# Altium schematic sheet 13_eMMC Flash.schdoc
size 309 x 223 mm; Symbol: Sheet-Symbol_A4; Device: Sheet-Symbol_A4; Company: 嘉立创EDA; Version: V1.0; Page Size: A4; @Project Name: RK3568核心板; @Page Count: 14; @Update Date: 2024-10-11; @Create Date: 2024-10-10; @Schematic Name: Schematic1; @Page No: 13; @Page Name: eMMC Flash; @Board Name: Board1; @Create Time: 14:33:53; @Update Time: 10:52:44
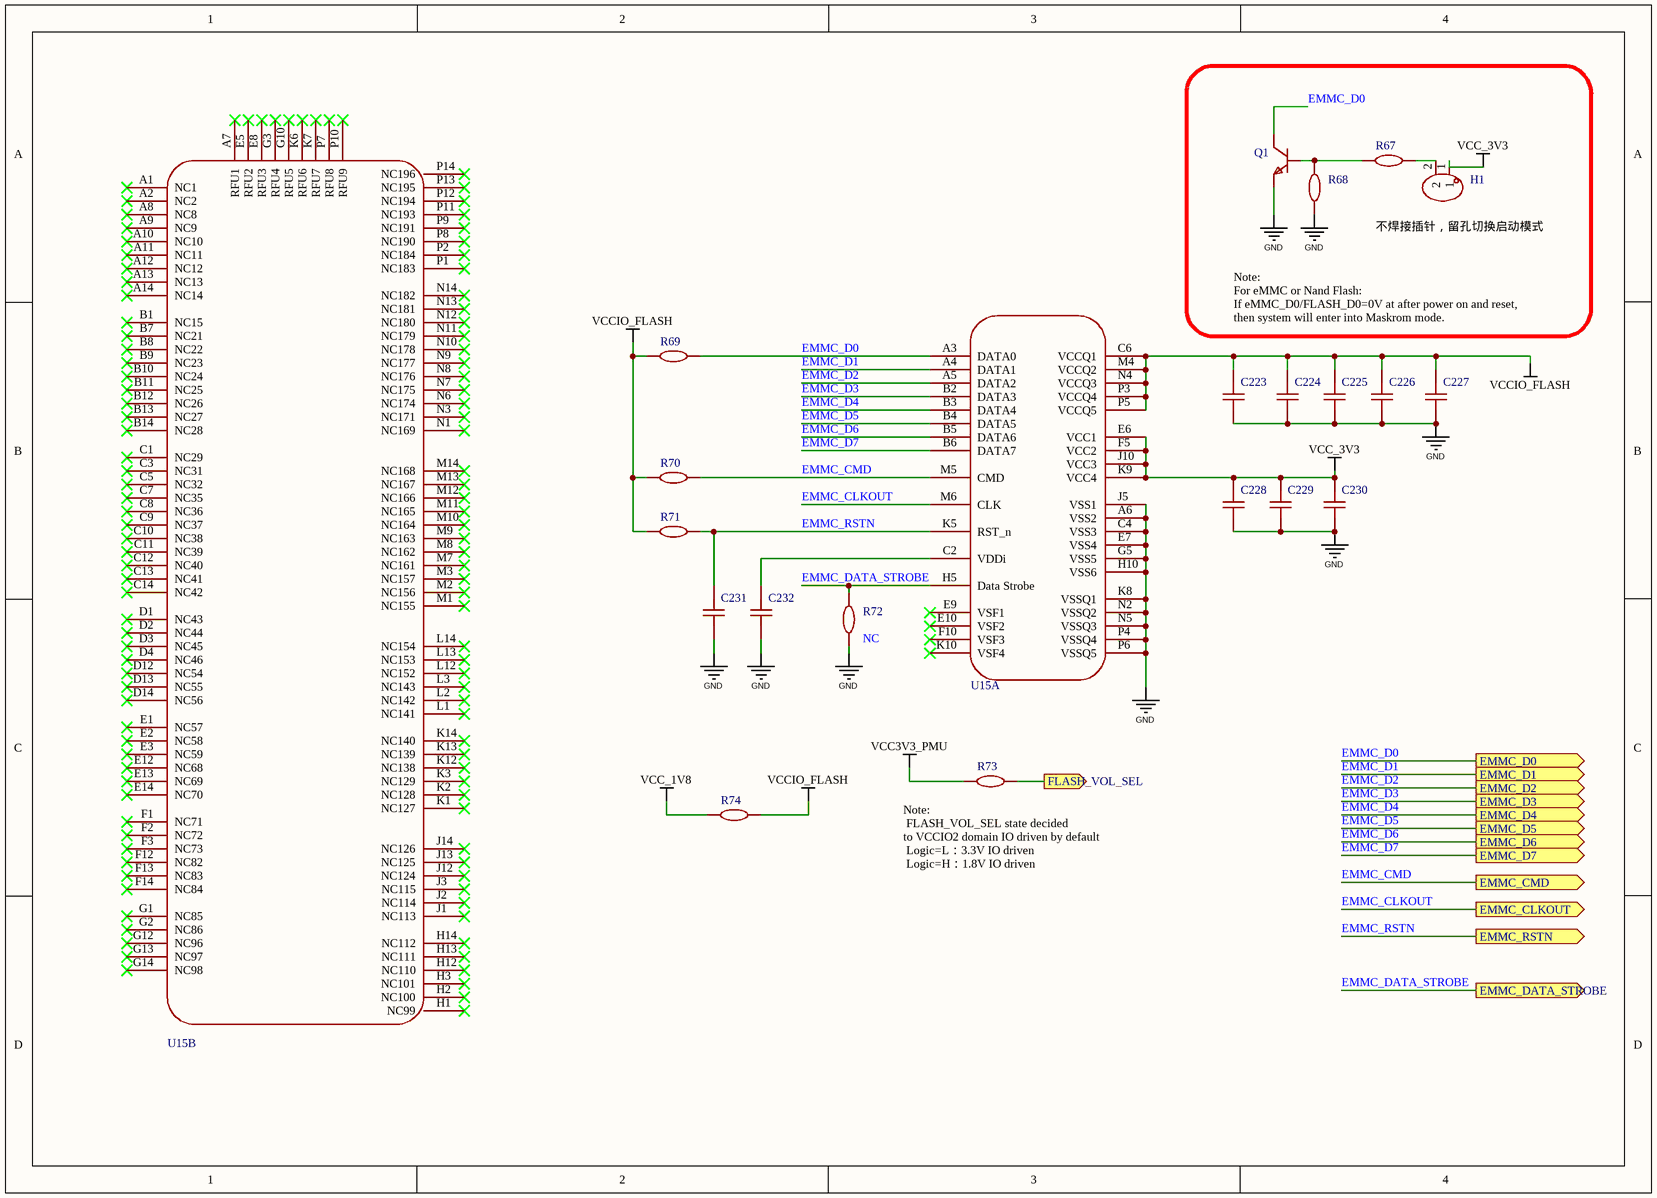
[diagram p0: 13_eMMC Flash.schdoc]

## Parts
C223  100nF  [C0402]  (value not drawn)
C224  100nF  [C0402]  (value not drawn)
C225  100nF  [C0402]  (value not drawn)
C226  100nF  [C0402]  (value not drawn)
C227  4.7uF  [C0402]  (value not drawn)
C228  100nF  [C0402]  (value not drawn)
C229  100nF  [C0402]  (value not drawn)
C230  4.7uF  [C0402]  (value not drawn)
C231  100nF  [C0402]  (value not drawn)
C232  2.2uF  [C0402]  (value not drawn)
H1  PZ254V-11-02P  [HDR-TH_2P-P2.54-V-M]  (value not drawn)
Q1  SS8050  [SOT-23-3_L2.9-W1.3-P1.90-LS2.4-BR]  (value not drawn)
R67  10kΩ  [R0402]  (value not drawn)
R68  47kΩ  [R0402]  (value not drawn)
R69  10kΩ  [R0402]  (value not drawn)
R70  10kΩ  [R0402]  (value not drawn)
R71  10kΩ  [R0402]  (value not drawn)
R72  47kΩ  [R0402]  (value not drawn)
R73  10kΩ  [R0402]  (value not drawn)
R74  0Ω  [R0603]  (value not drawn)
U15  KLMBG2JETD-B041  [FBGA-153_L8.5-W8.0-P0.50_EMMC32G-KC30-01]  (value not drawn)  (parts A,B of 2)

## Blocks framed on the sheet
不焊接插针，留孔切换启动模式: H1 Q1 R67 R68

## Ports
EMMC_CLKOUT (out), EMMC_CMD (out), EMMC_D0 (out), EMMC_D1 (out), EMMC_D2 (out), EMMC_D3 (out), EMMC_D4 (out), EMMC_D5 (out), EMMC_D6 (out), EMMC_D7 (out), EMMC_DATA_STROBE (out), EMMC_RSTN (out), FLASH_VOL_SEL (out)

## Nets
GND: C223.1 C224.1 C225.1 C226.1 C227.1 C228.1 C229.1 C230.1 C231.1 C232.2 Q1.2(E) R68.1 R72.1 U15.A6(VSS2) U15.C4(VSS3) U15.E7(VSS4) U15.G5(VSS5) U15.H10(VSS6) U15.J5(VSS1) U15.K8(VSSQ1) U15.N2(VSSQ2) U15.N5(VSSQ3) U15.P4(VSSQ4) U15.P6(VSSQ5)
VCC3V3_PMU: R73.1
VCC_1V8: R74.1
VCC_3V3: C228.2 C229.2 C230.2 H1.1 U15.E6(VCC1) U15.F5(VCC2) U15.J10(VCC3) U15.K9(VCC4)
VCCIO_FLASH: C223.2 C224.2 C225.2 C226.2 C227.2 R69.1 R70.1 R71.1 R74.2 U15.C6(VCCQ1) U15.M4(VCCQ2) U15.N4(VCCQ3) U15.P3(VCCQ4) U15.P5(VCCQ5)
EMMC_CLKOUT: U15.M6(CLK) ; port EMMC_CLKOUT
EMMC_CMD: R70.2 U15.M5(CMD) ; port EMMC_CMD
EMMC_D0: Q1.3(C) R69.2 U15.A3(DATA0) ; port EMMC_D0
EMMC_D1: U15.A4(DATA1) ; port EMMC_D1
EMMC_D2: U15.A5(DATA2) ; port EMMC_D2
EMMC_D3: U15.B2(DATA3) ; port EMMC_D3
EMMC_D4: U15.B3(DATA4) ; port EMMC_D4
EMMC_D5: U15.B4(DATA5) ; port EMMC_D5
EMMC_D6: U15.B5(DATA6) ; port EMMC_D6
EMMC_D7: U15.B6(DATA7) ; port EMMC_D7
EMMC_DATA_STROBE: R72.2 U15.H5(Data_Strobe) ; port EMMC_DATA_STROBE
EMMC_RSTN: C231.2 R71.2 U15.K5(RST_n) ; port EMMC_RSTN
FLASH_VOL_SEL: R73.2 ; port FLASH_VOL_SEL
NetC232_1: C232.1 U15.C2(VDDi)
NetH1_2: H1.2 R67.2
NetQ1_1: Q1.1(B) R67.1 R68.2

Not connected (* = marked no-connect by the designer): U15 A1(NC1)* A2(NC2)* A7(RFU1)* A8(NC8)* A9(NC9)* A10(NC10)* A11(NC11)* A12(NC12)* A13(NC13)* A14(NC14)* B1(NC15)* B7(NC21)* B8(NC22)* B9(NC23)* B10(NC24)* B11(NC25)* B12(NC26)* B13(NC27)* B14(NC28)* C1(NC29)* C3(NC31)* C5(NC32)* C7(NC35)* C8(NC36)* C9(NC37)* C10(NC38)* C11(NC39)* C12(NC40)* C13(NC41)* C14(NC42)* D1(NC43)* D2(NC44)* D3(NC45)* D4(NC46)* D12(NC54)* D13(NC55)* D14(NC56)* E1(NC57)* E2(NC58)* E3(NC59)* E5(RFU2)* E8(RFU3)* E9(VSF1)* E10(VSF2)* E12(NC68)* E13(NC69)* E14(NC70)* F1(NC71)* F2(NC72)* F3(NC73)* F10(VSF3)* F12(NC82)* F13(NC83)* F14(NC84)* G1(NC85)* G2(NC86)* G3(RFU4)* G10(RFU5)* G12(NC96)* G13(NC97)* G14(NC98)* H1(NC99)* H2(NC100)* H3(NC101)* H12(NC110)* H13(NC111)* H14(NC112)* J1(NC113)* J2(NC114)* J3(NC115)* J12(NC124)* J13(NC125)* J14(NC126)* K1(NC127)* K2(NC128)* K3(NC129)* K6(RFU6)* K7(RFU7)* K10(VSF4)* K12(NC138)* K13(NC139)* K14(NC140)* L1(NC141)* L2(NC142)* L3(NC143)* L12(NC152)* L13(NC153)* L14(NC154)* M1(NC155)* M2(NC156)* M3(NC157)* M7(NC161)* M8(NC162)* M9(NC163)* M10(NC164)* M11(NC165)* M12(NC166)* M13(NC167)* M14(NC168)* N1(NC169)* N3(NC171)* N6(NC174)* N7(NC175)* N8(NC176)* N9(NC177)* N10(NC178)* N11(NC179)* N12(NC180)* N13(NC181)* N14(NC182)* P1(NC183)* P2(NC184)* P7(RFU8)* P8(NC190)* P9(NC191)* P10(RFU9)* P11(NC193)* P12(NC194)* P13(NC195)* P14(NC196)*

## Notes on the sheet
- Note:
  For eMMC or Nand Flash:
  If eMMC_D0/FLASH_D0=0V at after power on and reset,
  then system will enter into Maskrom mode.
- (near R72) NC
- (near R73) Note:
  FLASH_VOL_SEL state decided
  to VCCIO2 domain IO driven by default
  Logic=L：3.3V IO driven
  Logic=H：1.8V IO driven
- 1
- 2
- 3
- 4
- 5
- 6
- A
- B
- C
- 原理图
- Schematic1
- 创建日期
- 更新日期
- 2024-10-11
- 2024-10-10
- 审阅
- 绘制
- 图页
- eMMC Flash
- 物料编码
- RK3568核心板
- D
- 版本
- 尺寸
- 页
- 13
- 共
- 14
- V1.0
- A4
- 嘉立创EDA

## Library data of the parts
C223-C226 C228 C229 C231 = CL05B104KB54PNC: 容值:100nF;精度:±10%;额定电压:50V;材质(温度系数):X7R;; Manufacturer: SAMSUNG(三星); Add into BOM: yes; Tolerance: ±10%; Voltage Rated: 50V; Temperature Coefficient: X7R; Symbol: CL05B104KB54PNC; Device: CL05B104KB54PNC; LCSC Part Name: 100nF ±10% 50V; Supplier Part: C307331; Manufacturer Part: CL05B104KB54PNC; Supplier Footprint: 0402; JLCPCB Part Class: 基础库; Datasheet: https://atta.szlcsc.com/upload/public/pdf/source/20160218/1457707763339.pdf; Supplier: LCSC; Convert to PCB: yes; Value: 100nF
C227 C230 = CL05A475KP5NRNC: 容值:4.7uF;精度:±10%;额定电压:10V;材质(温度系数):X5R;; Manufacturer: SAMSUNG(三星); Add into BOM: yes; Tolerance: ±10%; Voltage Rated: 10V; Temperature Coefficient: X5R; Symbol: CL05A475KP5NRNC; Device: CL05A475KP5NRNC; Supplier: LCSC; Supplier Part: C368809; Manufacturer Part: CL05A475KP5NRNC; Value: 4.7uF; JLCPCB Part Class: 扩展库; LCSC Part Name: 4.7uF ±10% 10V; Supplier Footprint: 0402; Datasheet: https://atta.szlcsc.com/upload/public/pdf/source/20160218/1457707763339.pdf; Convert to PCB: yes
C232 = CL05A225KO5NQNC: 容值:2.2uF;精度:±10%;额定电压:16V;材质(温度系数):X5R;; Manufacturer: SAMSUNG(三星); Add into BOM: yes; Tolerance: ±10%; Voltage Rated: 16V; Temperature Coefficient: X5R; Symbol: CL05A225KO5NQNC; Device: CL05A225KO5NQNC; LCSC Part Name: 2.2uF ±10% 16V; Supplier Part: C170151; Manufacturer Part: CL05A225KO5NQNC; Supplier Footprint: 0402; JLCPCB Part Class: 扩展库; Datasheet: https://atta.szlcsc.com/upload/public/pdf/source/20160218/1457707763339.pdf; Supplier: LCSC; Convert to PCB: yes; Value: 2.2uF
H1 = PZ254V-11-02P: 插针结构:1x2P;间距:2.54mm;行距:-;圆针/方针:方针;安装类型:直插;排数:单排;总PIN位数:2P;额定电流:-;额定电压:-;配合针长度:6mm;塑高:2.5mm;端接针长度:3mm;触头材质:黄铜;触头镀层:-;工作温度范围:-40℃~+105℃;颜色:黑色;; Manufacturer: XFCN(兴飞); Add into BOM: yes; Pin Structure: 1x2P; Pitch: 2.54mm; Circluar Pins/Square Pins: 方针; Symbol: PZ254V-11-02P; Device: PZ254V-11-02P; Supplier: LCSC; Supplier Part: C492401; Manufacturer Part: PZ254V-11-02P; JLCPCB Part Class: 扩展库; LCSC Part Name: 间距:2.54mm 1x2P 直插 方针; Supplier Footprint: 插件,P=2.54mm; Datasheet: https://atta.szlcsc.com/upload/public/pdf/source/20200309/C492401_A812433581A9B211A7FFA413ADDFF0E5.pdf; Convert to PCB: yes; Row Spacing: -; Mounting Type: 直插; Number of Rows: 单排; Number of Pins: 2P; Current Rating (Max): -; Voltage Rating (Max): -; Length of Mating Pin: 6mm; Insulation Height: 2.5mm; Length of End Connection Pin: 3mm; Contact Material: 黄铜; Contact Plating: -; Operating Temperature Range: -40℃~+105℃; Color: 黑色
Q1 = SS8050_C2150: 晶体管类型:NPN;集电极电流(Ic):1.5A;集射极击穿电压(Vceo):25V;功率(Pd):300mW;直流电流增益(hFE@Ic,Vce):200@100mA,1V;; Manufacturer: CJ(江苏长电/长晶); Add into BOM: yes; Transistor Type: NPN; Collector Current (Ic): 1.5A; Collector-Emitter Breakdown Voltage (Vceo): 25V; Power Dissipation (Pd): 300mW; Transition Frequency (fT): 100MHz; Collector Cut-Off Current (Icbo): 100nA; Collector-Emitter Saturation Voltage (VCE(sat)@Ic,Ib): 500mV@800mA,80mA; Symbol: SS8050_C2150; Device: SS8050_C2150; LCSC Part Name: SS8050(RANGE:200-350) hfe=200~350; Supplier Part: C2150; Manufacturer Part: SS8050; Supplier Footprint: SOT-23; JLCPCB Part Class: 基础库; Datasheet: https://atta.szlcsc.com/upload/public/pdf/source/20230322/AEE86F4B043774EFF80CAEA14A37D9E9.pdf; Supplier: LCSC; Convert to PCB: yes; DC Current Gain (hFE@Ic,Vce): 200@100mA,1V; Operating Temperature: -
R67 R69-R71 R73 = 0402WGF1002TCE: 电阻类型:厚膜电阻;阻值:10kΩ;精度:±1%;功率:62.5mW;最大工作电压:50V;温度系数:±100ppm/℃;; Manufacturer: UNI-ROYAL(厚声); Add into BOM: yes; Tolerance: ±1%; Power(Watts): 62.5mW; Overload Voltage (Max): 50V; Symbol: 0402WGF1002TCE; Device: 0402WGF1002TCE; LCSC Part Name: 10kΩ ±1% 62.5mW 厚膜电阻; Supplier Part: C25744; Manufacturer Part: 0402WGF1002TCE; Supplier Footprint: 0402; JLCPCB Part Class: 基础库; Datasheet: https://atta.szlcsc.com/upload/public/pdf/source/20200306/C422600_1E6D84923E4A46A82E41ADD87F860B5C.pdf; Supplier: LCSC; Convert to PCB: yes; Type: 厚膜电阻; Value: 10kΩ; Temperature Coefficient: ±100ppm/℃; Operating Temperature Range: -55℃~+155℃
R68 R72 = 0402WGF4702TCE: 电阻类型:厚膜电阻;阻值:47kΩ;精度:±1%;功率:62.5mW;最大工作电压:50V;温度系数:±100ppm/℃;; Manufacturer: UNI-ROYAL(厚声); Add into BOM: yes; Tolerance: ±1%; Power(Watts): 62.5mW; Overload Voltage (Max): 50V; Symbol: 0402WGF4702TCE; Device: 0402WGF4702TCE; Supplier: LCSC; Manufacturer Part: 0402WGF4702TCE; Supplier Part: C25792; Value: 47kΩ; JLCPCB Part Class: 基础库; LCSC Part Name: 47kΩ ±1% 62.5mW 厚膜电阻; Supplier Footprint: 0402; Datasheet: https://atta.szlcsc.com/upload/public/pdf/source/20200306/C422600_1E6D84923E4A46A82E41ADD87F860B5C.pdf; Convert to PCB: yes; Type: 厚膜电阻; Temperature Coefficient: ±100ppm/℃; Operating Temperature Range: -55℃~+155℃
R74 = 0603WAF0000T5E: 电阻类型:厚膜电阻;阻值:0Ω;精度:±1%;功率:100mW;最大工作电压:75V;; Manufacturer: UNI-ROYAL(厚声); Add into BOM: yes; Tolerance: ±1%; Power(Watts): 100mW; Overload Voltage (Max): 75V; Symbol: 0603WAF0000T5E; Device: 0603WAF0000T5E; LCSC Part Name: 0Ω ±1% 100mW 厚膜电阻; Supplier Part: C21189; Manufacturer Part: 0603WAF0000T5E; Supplier Footprint: 0603; JLCPCB Part Class: 基础库; Datasheet: https://atta.szlcsc.com/upload/public/pdf/source/20200306/C422600_1E6D84923E4A46A82E41ADD87F860B5C.pdf; Supplier: LCSC; Convert to PCB: yes; Type: 厚膜电阻; Value: 0Ω; Operating Temperature Range: -55℃~+155℃
U15 = KLMBG2JETD-B041: Symbol: EMMC_B153_2L; 规格: eMMC 容量：32G 工作电压 Interface power : VDD (1.70V ~ 1.95V or 2.7V ~ 3.6V) Memory power : VDDF (2.7V ~ 3.6V); 条码: EBF2950033; 品牌: 三星; 类别: 存储器-eMMC; 规格书: KLMBG2JETD-B041.pdf; 生命周期: 量产; Add into BOM: yes; Relevance: []; Device: KLMBG2JETD-B041; 规格编号: KLMBG2JETD-B041; Convert to PCB: yes